# EasyEDA Pro project SCH_and_PCB.epro, schematic 四路运放aht
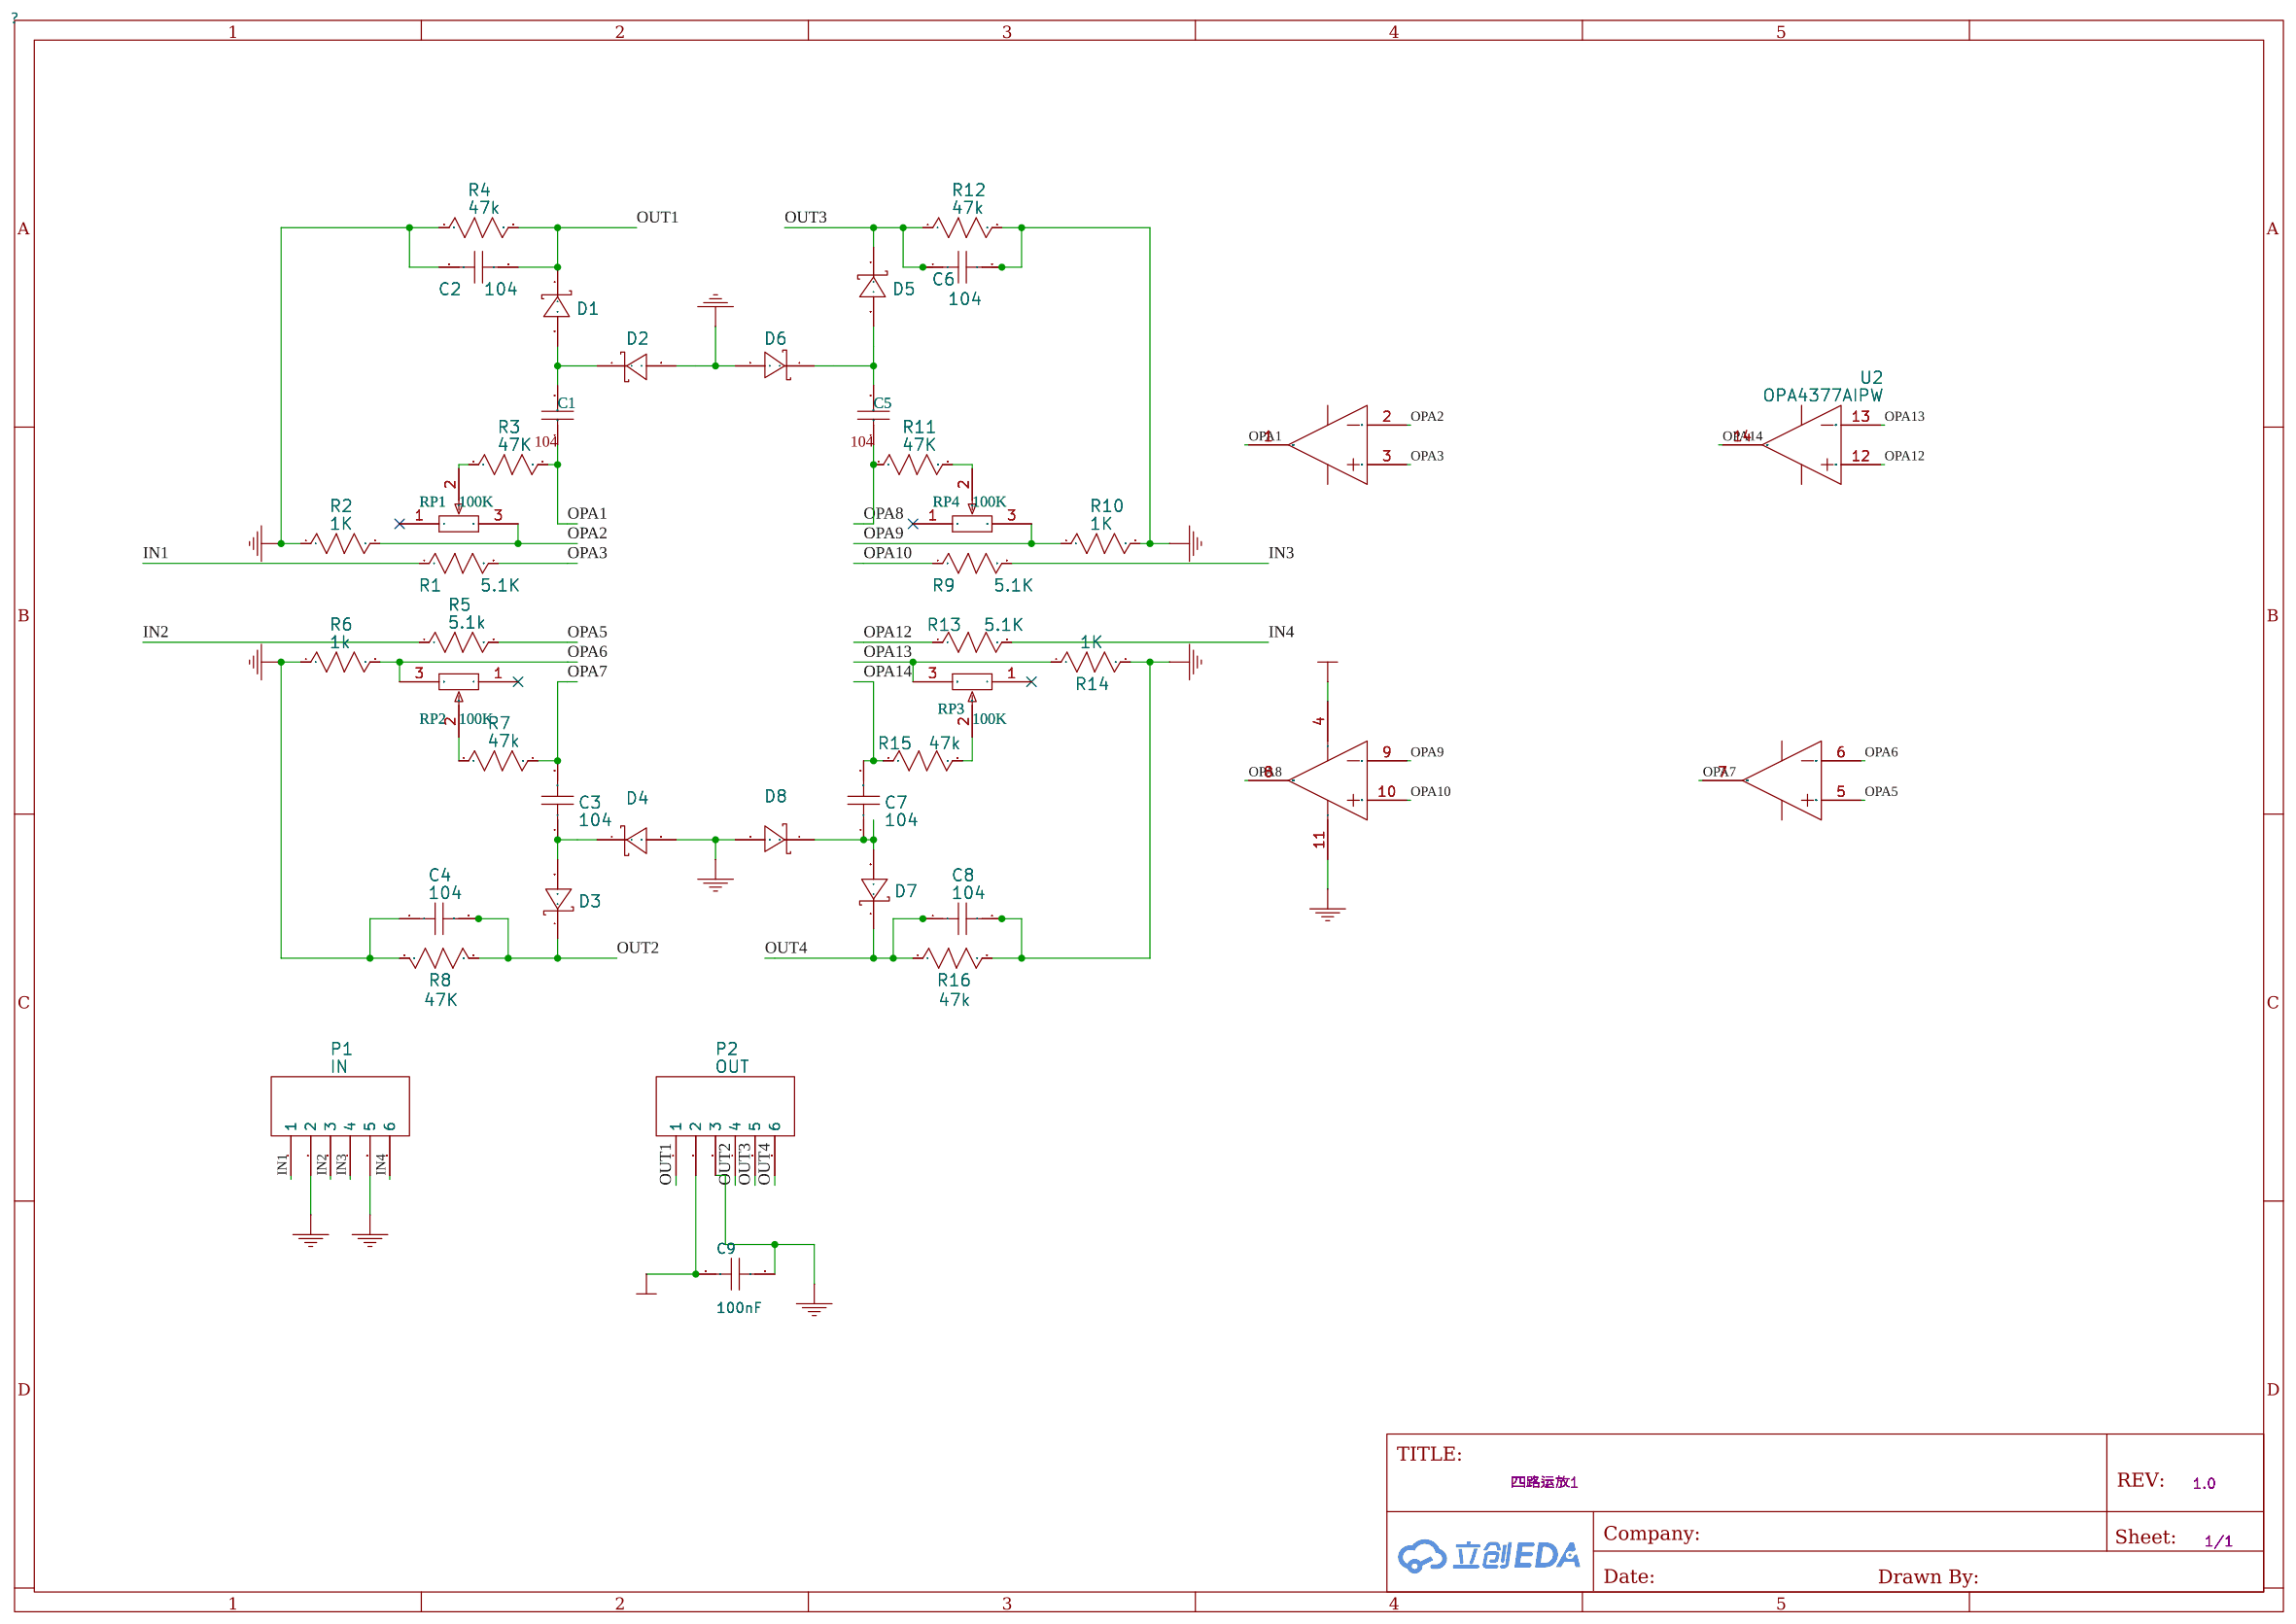
[diagram p3: schematic sheet]

## Parts
C1  104  [C0603]
C2  104  [C0603]
C3  104  [C0603]
C4  104  [C0603]
C5  104  [C0603]
C6  104  [C0603]
C7  104  [C0603]
C8  104  [C0603]
C9  100nF  [C0805]
D1  B5819W  [SOD-123_L2.8-W1.8-LS3.7-RD]
D2  B5819W  [SOD-123_L2.8-W1.8-LS3.7-RD]
D3  B5819W  [SOD-123_L2.8-W1.8-LS3.7-RD]
D4  B5819W  [SOD-123_L2.8-W1.8-LS3.7-RD]
D5  B5819W  [SOD-123_L2.8-W1.8-LS3.7-RD]
D6  B5819W  [SOD-123_L2.8-W1.8-LS3.7-RD]
D7  B5819W  [SOD-123_L2.8-W1.8-LS3.7-RD]
D8  B5819W  [SOD-123_L2.8-W1.8-LS3.7-RD]
P1  IN  [HDR1X6-M]
P2  OUT  [HDR1X6-M]
R1  5.1K  [R0603]
R2  1K  [R0603]
R3  47K  [R0603]
R4  47k  [R0603]
R5  5.1k  [R0603]
R6  1k  [R0603]
R7  47k  [R0603]
R8  47K  [R0603]
R9  5.1K  [R0603]
R10  1K  [R0603]
R11  47K  [R0603]
R12  47k  [R0603]
R13  5.1K  [R0603]
R14  1K  [R0603]
R15  47k  [R0603]
R16  47k  [R0603]
RP1  100K  [RES-ADJ-TH_3296W-1-203]
RP2  100K  [RES-ADJ-TH_3296W-1-203]
RP3  100K  [RES-ADJ-TH_3296W-1-203]
RP4  100K  [RES-ADJ-TH_3296W-1-203]
U2  OPA4377AIPW  [TSSOP-14_L5.0-W4.4-P0.65-LS6.4-BL]

## Library data of the parts
C1 C5 = 104: link: https://item.szlcsc.com/373011.html; 3DModel: C0805_L2.0-W1.3-H1.3; 常见贴片电容尺寸图: https://wenku.baidu.com/view/21d5206100f69e3143323968011ca300a6c3f6b2.html
C2-C4 C6-C8 = 104: link: https://item.szlcsc.com/373011.html; 3DModel: C0805_L2.0-W1.3-H1.3
C9 = CAP_0805: Supplier Footprint: 0805
D1-D8 = B5819W: link: https://item.szlcsc.com/301422.html; Supplier: LCSC; Manufacturer: MDD; Supplier Part: C64885; JLCPCB Part Class: ExtendedPart
P1 P2 = Header-D-M 1x6P: Revision: V1.0
R1 R9 R13 = 5.1K: link: https://www.mouser.in/datasheet/2/447/PYu_RT_1_to_0_01_RoHS_L_11-1669912.pdf
R2 R10 R14 = 1K: link: https://www.mouser.in/datasheet/2/447/PYu_RT_1_to_0_01_RoHS_L_11-1669912.pdf
R3 R8 R11 = 47K: link: https://www.mouser.in/datasheet/2/447/PYu_RT_1_to_0_01_RoHS_L_11-1669912.pdf
R4 R7 R12 R15 R16 = 47k: link: https://www.mouser.in/datasheet/2/447/PYu_RT_1_to_0_01_RoHS_L_11-1669912.pdf
R5 = 5.1k: link: https://www.mouser.in/datasheet/2/447/PYu_RT_1_to_0_01_RoHS_L_11-1669912.pdf
R6 = 1k: link: https://www.mouser.in/datasheet/2/447/PYu_RT_1_to_0_01_RoHS_L_11-1669912.pdf
RP1-RP4 = 100K: link: https://atta.szlcsc.com/upload/public/pdf/source/20181127/C330433_9BFE7708174FA61A8C7E4F666ACACFF1.pdf; 3DModel: RES-ADJ-TH_3296W-L; 购买链接: https://item.taobao.com/item.htm?spm=a230r.1.14.90.21641e34zQj3ul&amp;id=19303265869&amp;ns=1&amp;abbucket=13#detail
U2 = OPA4377AIPW: link: https://atta.szlcsc.comnull; 3DModel: TSSOP-14_L5.0-W4.4-H1.0-LS6.4-P0.65; Supplier: LCSC; Supplier Part: C1346362; Manufacturer: TI(德州仪器); JLCPCB Part Class: ExtendedPart

## Nets
+5V: C9.1 P2.2 U2.4(V+)
GND: C2.1 C4.1 C6.2 C8.2 C9.2 D2.2(A) D4.2(A) D6.2(A) D8.2(A) P1.2 P1.5 P2.3 R2.1 R4.1 R6.1 R8.1 R10.2 R12.2 R14.2 R16.2 U2.11(V-)
IN1: P1.1 R1.1
IN2: P1.3 R5.1
IN3: P1.4 R9.2
IN4: P1.6 R13.2
OPA1: C1.1 R3.2 U2.1(OUT A)
OPA2: R2.2 RP1.3 U2.2(IN A-)
OPA3: R1.2 U2.3(IN A+)
OPA5: R5.2 U2.5(IN B+)
OPA6: R6.2 RP2.3 U2.6(IN B-)
OPA7: C3.2 R7.2 U2.7(OUT B)
OPA8: C5.1 R11.1 U2.8(OUT C)
OPA9: R10.1 RP4.3 U2.9(IN C-)
OPA10: R9.1 U2.10(IN C+)
OPA12: R13.1 U2.12(IN D+)
OPA13: R14.1 RP3.3 U2.13(IN D-)
OPA14: C7.2 R15.1 U2.14(OUT D)
OUT1: C2.2 D1.1(K) P2.1 R4.2
OUT2: C4.2 D3.1(K) P2.4 R8.2
OUT3: C6.1 D5.1(K) P2.5 R12.1
OUT4: C8.1 D7.1(K) P2.6 R16.1
$1N136: C3.1 D3.2(A) D4.1(K)
$1N137: R7.1 RP2.2
$1N146: C7.1 D7.2(A) D8.1(K)
$1N147: R15.2 RP3.2
$1N192: R3.1 RP1.2
$1N206: C5.2 D5.2(A) D6.1(K)
$1N209: C1.2 D1.2(A) D2.1(K)
$1N214: R11.2 RP4.2

Not connected (* = marked no-connect by the designer): RP1 1*; RP2 1*; RP3 1*; RP4 1*
